# EAGLE design USB3.0 to SATA (EAGLE 9.6.2)

## Sheet 1 of 2: Control_Board
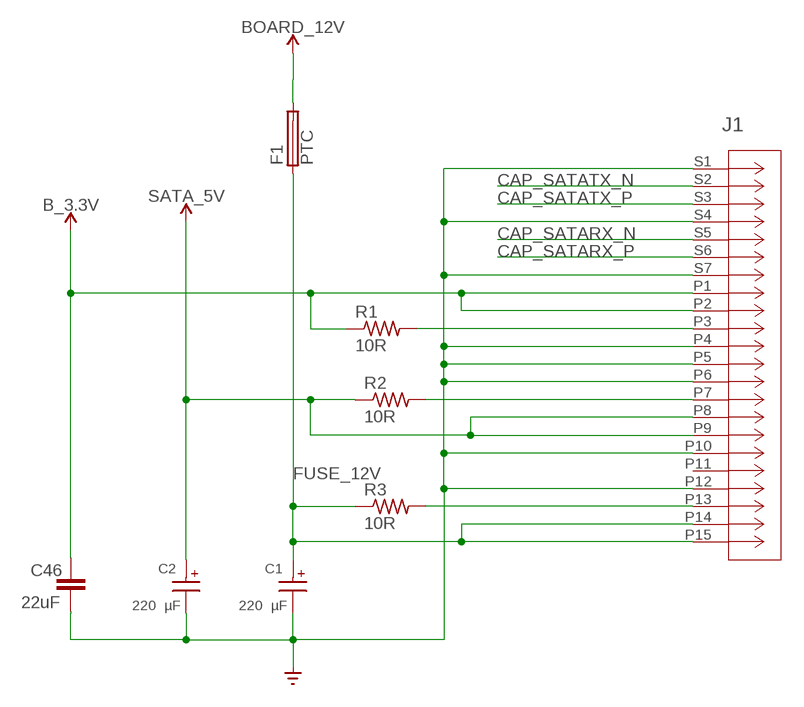
[diagram p0: schematic, sheet 1, part 1 of 2]
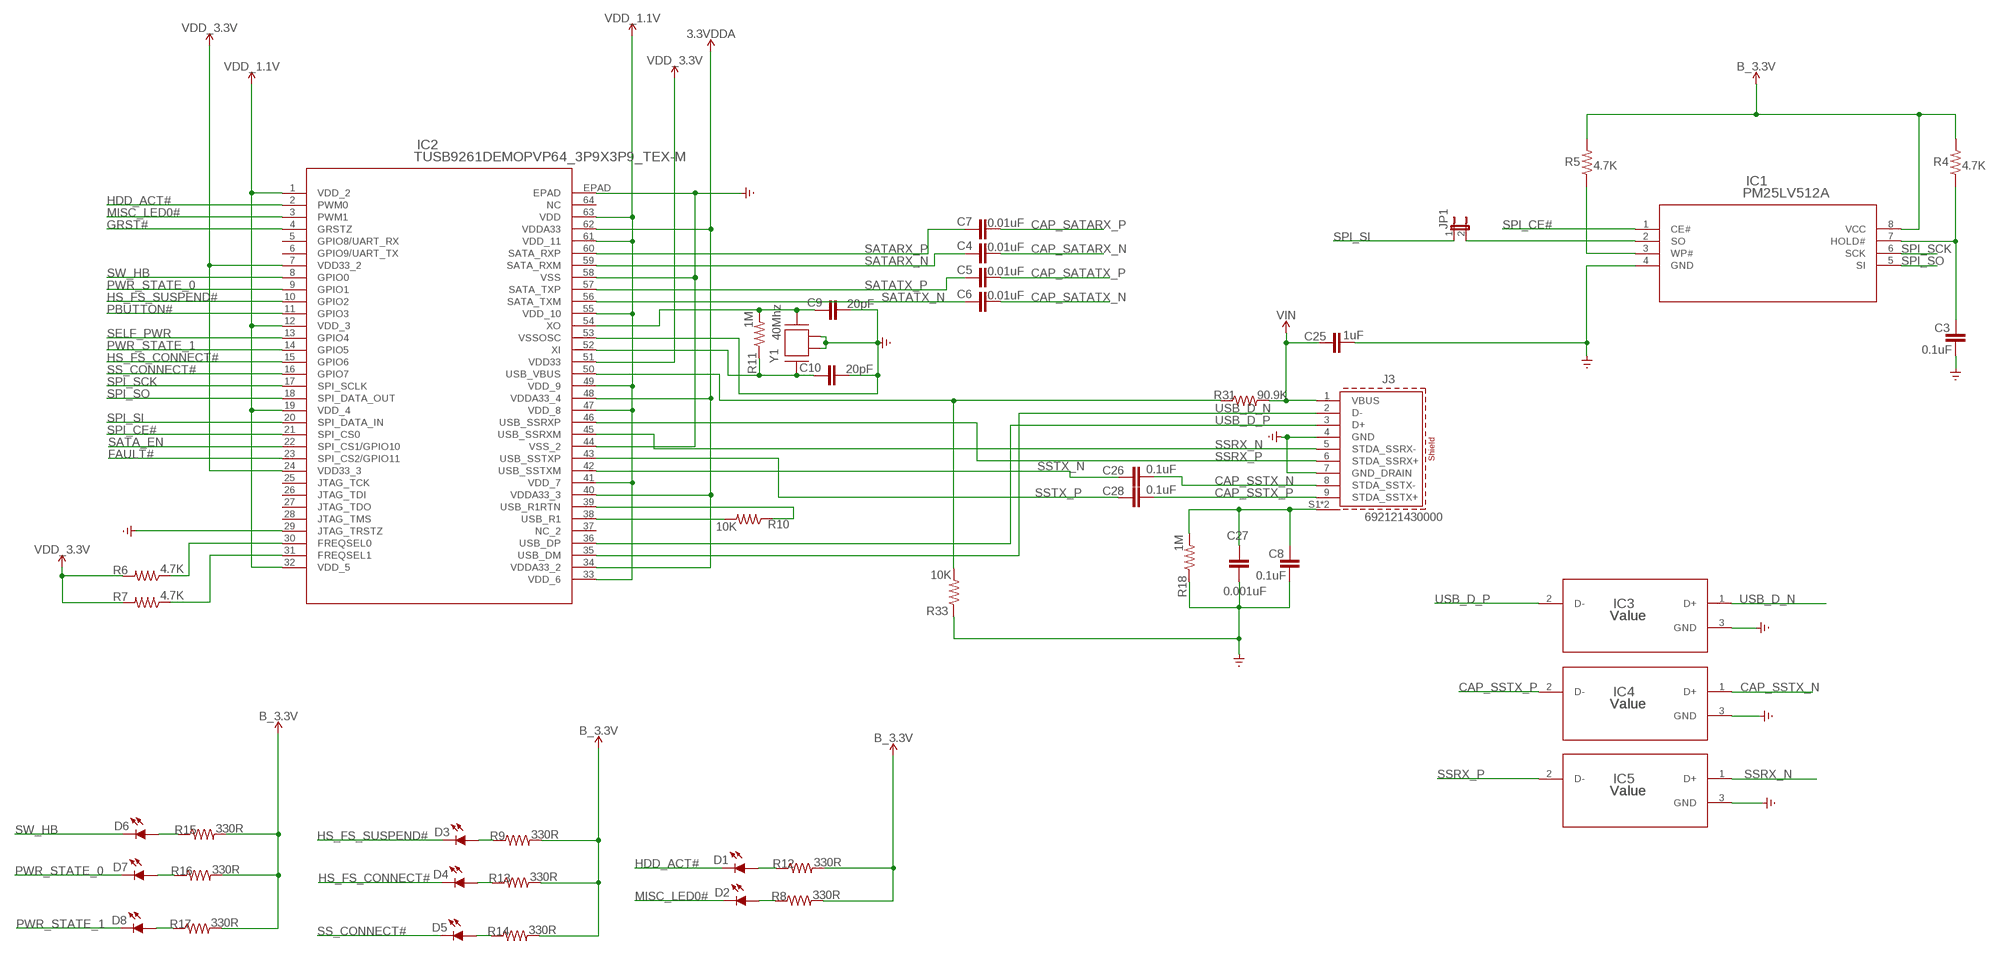
[diagram p1: schematic, sheet 1, part 2 of 2]

### Parts
C1  220 µF  WCAP-ATUL_8X11.5_860040374004  [WCAP-ATUL_8X11.5(DXL)]
C2  220 µF  WCAP-ATUL_8X11.5_860040374004  [WCAP-ATUL_8X11.5(DXL)]
C3  0.1uF  CC0402CRNPO9BN1R0  [CAP_0402]
C4  0.01uF  CC0402CRNPO9BN1R0  [CAP_0402]
C5  0.01uF  CC0402CRNPO9BN1R0  [CAP_0402]
C6  0.01uF  CC0402CRNPO9BN1R0  [CAP_0402]
C7  0.01uF  CC0402CRNPO9BN1R0  [CAP_0402]
C8  0.1uF  CC0402CRNPO9BN1R0  [CAP_0402]
C9  20pF  CC0402CRNPO9BN1R0  [CAP_0402]
C10  20pF  CC0402CRNPO9BN1R0  [CAP_0402]
C25  1uF  CC0402CRNPO9BN1R0  [CAP_0402]
C26  0.1uF  CC0402CRNPO9BN1R0  [CAP_0402]
C27  0.001uF  CC0402CRNPO9BN1R0  [CAP_0402]
C28  0.1uF  CC0402CRNPO9BN1R0  [CAP_0402]
C46  22uF  CC0402CRNPO9BN1R0  [CAP_0402]
D1  LED_LEDCHIP-LED0603MP  [LED_CHIP-LED0603MP]
D2  LED_LEDCHIP-LED0603MP  [LED_CHIP-LED0603MP]
D3  LED_LEDCHIP-LED0603MP  [LED_CHIP-LED0603MP]
D4  LED_LEDCHIP-LED0603MP  [LED_CHIP-LED0603MP]
D5  LED_LEDCHIP-LED0603MP  [LED_CHIP-LED0603MP]
D6  LED_LEDCHIP-LED0603MP  [LED_CHIP-LED0603MP]
D7  LED_LEDCHIP-LED0603MP  [LED_CHIP-LED0603MP]
D8  LED_LEDCHIP-LED0603MP  [LED_CHIP-LED0603MP]
F1  PTC  FUSE_NANOSMDC020F-2_CHIP-1206  [FUSC3215X82N]
IC1  PM25LV512A  [SOIC8-N_MC_MCH]
IC2  TUSB9261DEMOPVP64_3P9X3P9_TEX-M  [PVP64_3P9X3P9_TEX-M]
IC3  Value  TPD2EUSB30DRTR  [DRT0003A]
IC4  Value  TPD2EUSB30DRTR  [DRT0003A]
IC5  Value  TPD2EUSB30DRTR  [DRT0003A]
J1  10031569-001LF  [CONN_10031569-001LF_AMP]
J3  692121430000  [692121430000]
JP1  JP1E  [JP1]
R1  10R  RC0603JR-070RL  [RES_0603]
R2  10R  RC0603JR-070RL  [RES_0603]
R3  10R  RC0603JR-070RL  [RES_0603]
R4  4.7K  RC0402JR-070RL  [RES_0402]
R5  4.7K  RC0402JR-070RL  [RES_0402]
R6  4.7K  RC0402JR-070RL  [RES_0402]
R7  4.7K  RC0402JR-070RL  [RES_0402]
R8  330R  RC0603JR-070RL  [RES_0603]
R9  330R  RC0603JR-070RL  [RES_0603]
R10  10K  RC0402JR-070RL  [RES_0402]
R11  1M  RC0402JR-070RL  [RES_0402]
R12  330R  RC0603JR-070RL  [RES_0603]
R13  330R  RC0603JR-070RL  [RES_0603]
R14  330R  RC0603JR-070RL  [RES_0603]
R15  330R  RC0603JR-070RL  [RES_0603]
R16  330R  RC0603JR-070RL  [RES_0603]
R17  330R  RC0603JR-070RL  [RES_0603]
R18  1M  RC0402JR-070RL  [RES_0402]
R31  90.9K  RC0402JR-070RL  [RES_0402]
R33  10K  RC0402JR-070RL  [RES_0402]
Y1  40Mhz  ABM3B-40.000MHZ-B2-T  [ABM3B-40.000MHZ-B2-T]

### Nets
2.8V [Power]: IC2.7(VDD33_2) IC2.24(VDD33_3) IC2.51(VDD33) R6.2 R7.2 ; supply symbol labelled VDD_3.3V ; also sheet 2
3.3VDDA [Power]: IC2.34(VDDA33_2) IC2.40(VDDA33_3) IC2.48(VDDA33_4) IC2.62(VDDA33) ; also sheet 2
5V [Power]: C2.1(+) J1.P8 J1.P9 R2.1 ; supply symbol labelled SATA_5V ; also sheet 2
12V [Power]: F1.2 ; supply symbol labelled BOARD_12V ; also sheet 2
B_3.3V [Power]: C46.2 IC1.8(VCC) J1.P1 J1.P2 R1.1 R4.2 R5.2 R8.2 R9.2 R12.2 R13.2 R14.2 R15.2 R16.2 R17.2 ; also sheet 2
CAP_SATARX_N [Diff_Pair]: C4.2 J1.S5
CAP_SATARX_P [Diff_Pair]: C7.2 J1.S6
CAP_SATATX_N [Diff_Pair]: C6.2 J1.S2
CAP_SATATX_P [Diff_Pair]: C5.2 J1.S3
CAP_SSTX_N [Diff_Pair]: C26.1 IC4.1(D+) J3.8(STDA_SSTX-)
CAP_SSTX_P [Diff_Pair]: C28.1 IC4.2(D-) J3.9(STDA_SSTX+)
FAULT#: IC2.23(SPI_CS2/GPIO11) ; also sheet 2
FUSE_12V [Power]: C1.1(+) F1.1 J1.P14 J1.P15 R3.1
GND [Power]: C1.2(-) C2.2(-) C3.1 C8.1 C9.2 C10.2 C25.1 C27.2 C46.1 IC1.4(GND) IC2.29(JTAG_TRSTZ) IC2.44(VSS_2) IC2.53(VSSOSC) IC2.58(VSS) IC2.EPAD IC3.3(GND) IC4.3(GND) IC5.3(GND) J1.P4 J1.P5 J1.P6 J1.P10 J1.P12 J1.S1 J1.S4 J1.S7 J3.4(GND) J3.7(GND_DRAIN) R18.1 R33.1 Y1.2 Y1.4 ; also sheet 2
GRST#: IC2.4(GRSTZ) ; also sheet 2
HDD_ACT#: D1.C IC2.2(PWM0)
HS_FS_CONNECT#: D4.C IC2.15(GPIO6)
HS_FS_SUSPEND#: D3.C IC2.10(GPIO2)
MISC_LED0#: D2.C IC2.3(PWM1)
N$1: J1.P3 R1.2
N$2: J1.P13 R3.2
N$3: J1.P7 R2.2
N$16: IC1.2(SO) JP1.2
N$18: IC1.3(WP#) R5.1
N$19: C3.2 IC1.7(HOLD#) R4.1
N$22: IC2.30(FREQSEL0) R6.1
N$23: IC2.31(FREQSEL1) R7.1
N$24: IC2.38(USB_R1) R10.2
N$25: IC2.39(USB_R1RTN) R10.1
N$26: C10.1 IC2.52(XI) R11.1 Y1.1
N$27: C9.1 IC2.54(XO) R11.2 Y1.3
N$28: D1.A R12.1
N$29: D2.A R8.1
N$30: D3.A R9.1
N$31: D4.A R13.1
N$32: D5.A R14.1
N$33: D6.A R15.1
N$34: D7.A R16.1
N$35: D8.A R17.1
N$50: IC2.50(USB_VBUS) R31.1 R33.2
N$54: C8.2 C27.1 J3.S1(SHIELD) J3.S2(SHIELD) R18.2
PBUTTON#: IC2.11(GPIO3)
PWR_STATE_0: D7.C IC2.9(GPIO1)
PWR_STATE_1: D8.C IC2.14(GPIO5)
SATA_EN: IC2.22(SPI_CS1/GPIO10) ; also sheet 2
SATARX_N [Diff_Pair]: C4.1 IC2.59(SATA_RXM)
SATARX_P [Diff_Pair]: C7.1 IC2.60(SATA_RXP)
SATATX_N [Diff_Pair]: C6.1 IC2.56(SATA_TXM)
SATATX_P [Diff_Pair]: C5.1 IC2.57(SATA_TXP)
SELF_PWR: IC2.13(GPIO4)
SPI_CE#: IC1.1(CE#) IC2.21(SPI_CS0)
SPI_SCK: IC1.6(SCK) IC2.17(SPI_SCLK)
SPI_SI: IC2.20(SPI_DATA_IN) JP1.1
SPI_SO: IC1.5(SI) IC2.18(SPI_DATA_OUT)
SS_CONNECT#: D5.C IC2.16(GPIO7)
SSRX_N [Diff_Pair]: IC2.45(USB_SSRXM) IC5.1(D+) J3.5(STDA_SSRX-)
SSRX_P [Diff_Pair]: IC2.46(USB_SSRXP) IC5.2(D-) J3.6(STDA_SSRX+)
SSTX_N [Diff_Pair]: C26.2 IC2.42(USB_SSTXM)
SSTX_P [Diff_Pair]: C28.2 IC2.43(USB_SSTXP)
SW_HB: D6.C IC2.8(GPIO0)
USB_D_N [Diff_Pair]: IC2.35(USB_DM) IC3.1(D+) J3.2(D-)
USB_D_P [Diff_Pair]: IC2.36(USB_DP) IC3.2(D-) J3.3(D+)
VDD_1.1V [Power]: IC2.1(VDD_2) IC2.12(VDD_3) IC2.19(VDD_4) IC2.32(VDD_5) IC2.33(VDD_6) IC2.41(VDD_7) IC2.47(VDD_8) IC2.49(VDD_9) IC2.55(VDD_10) IC2.61(VDD_11) IC2.63(VDD) ; also sheet 2
VIN [Power]: C25.2 J3.1(VBUS) R31.2 ; also sheet 2
Unconnected: IC2.5(GPIO8/UART_RX) IC2.6(GPIO9/UART_TX) IC2.25(JTAG_TCK) IC2.26(JTAG_TDI) IC2.27(JTAG_TDO) IC2.28(JTAG_TMS) IC2.37(NC_2) IC2.64(NC) J1.P11

## Sheet 2 of 2: Power
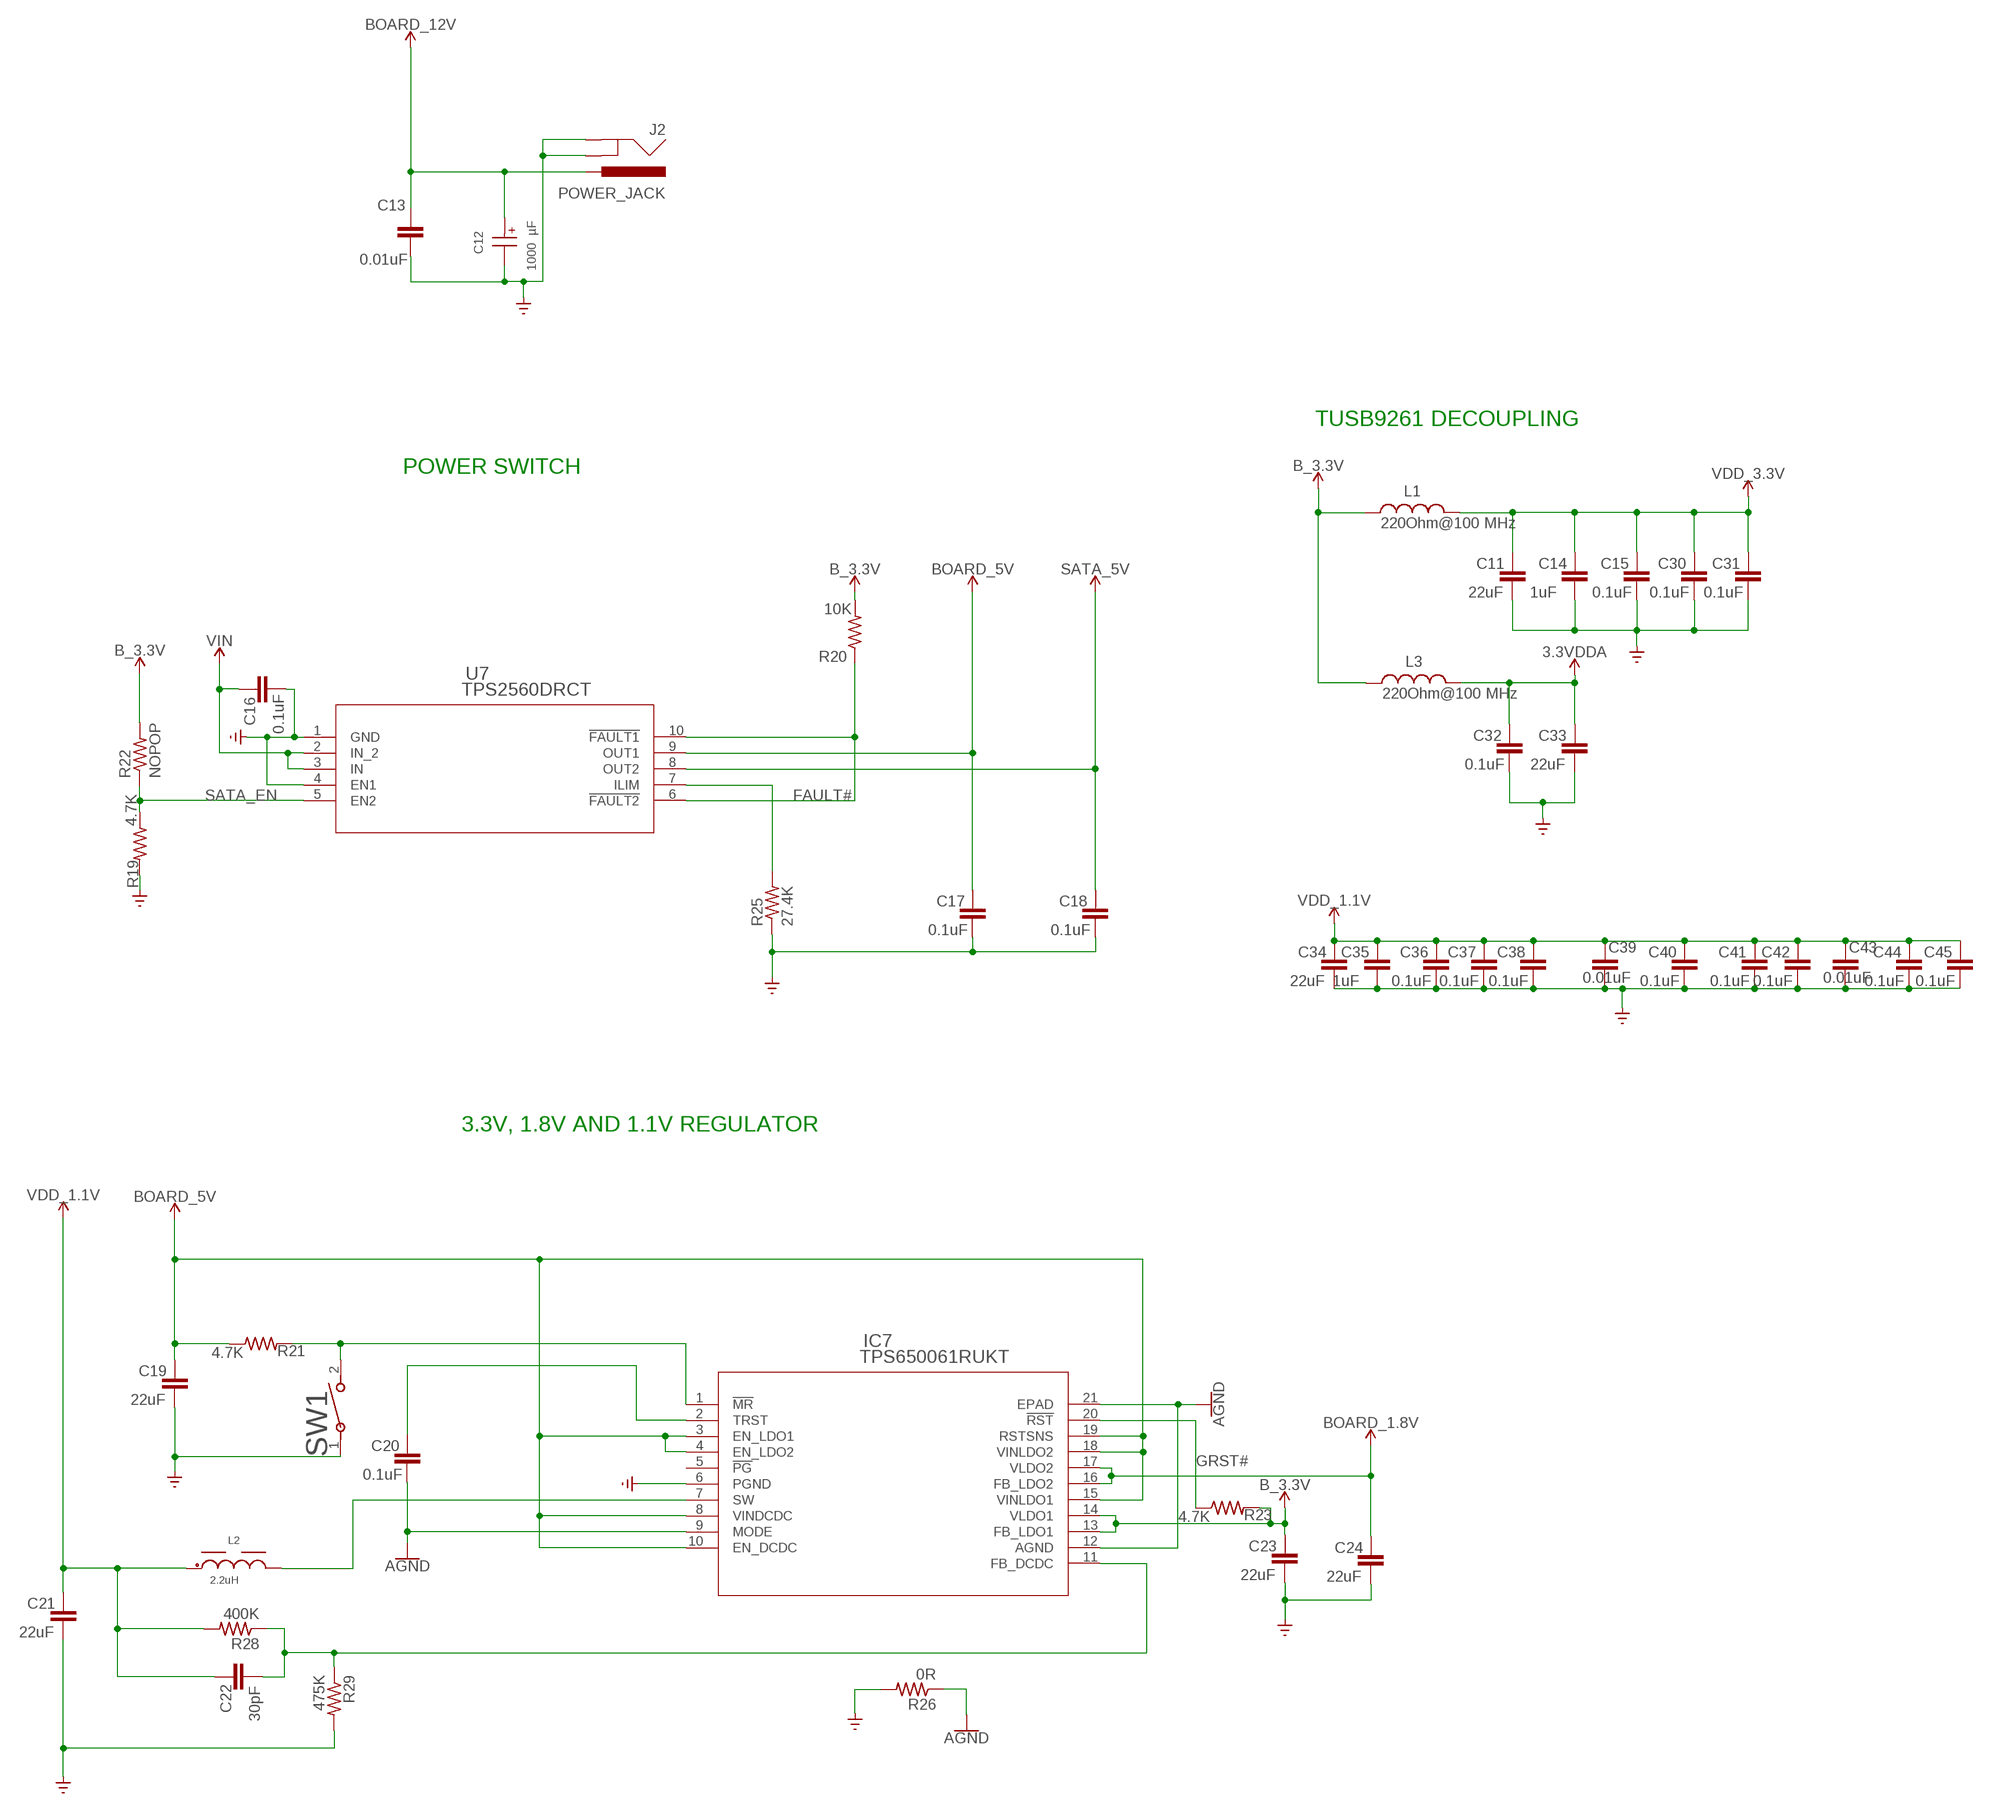
[diagram p2: schematic, sheet 2]

### Parts
C11  22uF  CC0402CRNPO9BN1R0  [CAP_0402]
C12  1000 µF  WCAP-ATLL_10X16_860160375032  [WCAP-ATLL_10X16(DXL)]
C13  0.01uF  CC0402CRNPO9BN1R0  [CAP_0402]
C14  1uF  CC0402CRNPO9BN1R0  [CAP_0402]
C15  0.1uF  CC0402CRNPO9BN1R0  [CAP_0402]
C16  0.1uF  CC0402CRNPO9BN1R0  [CAP_0402]
C17  0.1uF  CC0402CRNPO9BN1R0  [CAP_0402]
C18  0.1uF  CC0402CRNPO9BN1R0  [CAP_0402]
C19  22uF  CC0402CRNPO9BN1R0  [CAP_0402]
C20  0.1uF  CC0402CRNPO9BN1R0  [CAP_0402]
C21  22uF  CC0402CRNPO9BN1R0  [CAP_0402]
C22  30pF  CC0402CRNPO9BN1R0  [CAP_0402]
C23  22uF  CC0402CRNPO9BN1R0  [CAP_0402]
C24  22uF  CC0402CRNPO9BN1R0  [CAP_0402]
C30  0.1uF  CC0402CRNPO9BN1R0  [CAP_0402]
C31  0.1uF  CC0402CRNPO9BN1R0  [CAP_0402]
C32  0.1uF  CC0402CRNPO9BN1R0  [CAP_0402]
C33  22uF  CC0402CRNPO9BN1R0  [CAP_0402]
C34  22uF  CC0402CRNPO9BN1R0  [CAP_0402]
C35  1uF  CC0402CRNPO9BN1R0  [CAP_0402]
C36  0.1uF  CC0402CRNPO9BN1R0  [CAP_0402]
C37  0.1uF  CC0402CRNPO9BN1R0  [CAP_0402]
C38  0.1uF  CC0402CRNPO9BN1R0  [CAP_0402]
C39  0.01uF  CC0402CRNPO9BN1R0  [CAP_0402]
C40  0.1uF  CC0402CRNPO9BN1R0  [CAP_0402]
C41  0.1uF  CC0402CRNPO9BN1R0  [CAP_0402]
C42  0.1uF  CC0402CRNPO9BN1R0  [CAP_0402]
C43  0.01uF  CC0402CRNPO9BN1R0  [CAP_0402]
C44  0.1uF  CC0402CRNPO9BN1R0  [CAP_0402]
C45  0.1uF  CC0402CRNPO9BN1R0  [CAP_0402]
IC7  TPS650061RUKT  [RUK20_1P7X1P7]
J2  POWER_JACK  [POWER_JACK_PTH]
L1  220Ohm@100 MHz  WE-CBF_0603_74279263_WB_HS  [WE-CBF_0603(W=2.2)]
L2  2.2uH  WE-MAPI_4020_74438356022  [WE-MAPI_4020]
L3  220Ohm@100 MHz  WE-CBF_0603_74279263_WB_HS  [WE-CBF_0603(W=2.2)]
R19  4.7K  RC0402JR-070RL  [RES_0402]
R20  10K  RC0402JR-070RL  [RES_0402]
R21  4.7K  RC0402JR-070RL  [RES_0402]
R22  NOPOP  RC0402JR-070RL  [RES_0402]
R23  4.7K  RC0402JR-070RL  [RES_0402]
R25  27.4K  RC0402JR-070RL  [RES_0402]
R26  0R  RC0402JR-070RL  [RES_0402]
R28  400K  RC0402JR-070RL  [RES_0402]
R29  475K  RC0402JR-070RL  [RES_0402]
SW1  EVP-AWED2A  [SW_EVP-AWED2A_PAN]
U7  TPS2560DRCT  [DRC10_2P4X1P65]

### Nets
1.8V [Power]: C24.2 IC7.16(FB_LDO2) IC7.17(VLDO2) ; supply symbol labelled BOARD_1.8V
2.8V [Power]: C11.2 C14.2 C15.2 C30.2 C31.2 L1.2 ; supply symbol labelled VDD_3.3V ; also sheet 1
3.3VDDA [Power]: C32.2 C33.2 L3.2 ; also sheet 1
5V [Power]: C18.2 U7.8(OUT2) ; supply symbol labelled SATA_5V ; also sheet 1
12V [Power]: C12.1(+) C13.1 J2.PWR ; supply symbol labelled BOARD_12V ; also sheet 1
AGND [Power]: C20.1 IC7.9(MODE) IC7.12(AGND) IC7.21(EPAD) R26.1
B_3.3V [Power]: C23.2 IC7.13(FB_LDO1) IC7.14(VLDO1) L1.1 L3.1 R20.2 R22.2 R23.2 ; also sheet 1
BOARD_5V [Power]: C17.2 C19.2 IC7.3(EN_LDO1) IC7.4(EN_LDO2) IC7.8(VINDCDC) IC7.10(EN_DCDC) IC7.15(VINLDO1) IC7.18(VINLDO2) IC7.19(RSTSNS) R21.1 U7.9(OUT1)
FAULT#: R20.1 U7.6(!FAULT2) U7.10(!FAULT1) ; also sheet 1
GND [Power]: C11.1 C12.2(-) C13.2 C14.1 C15.1 C16.1 C17.1 C18.1 C19.1 C21.1 C23.1 C24.1 C30.1 C31.1 C32.1 C33.1 C34.1 C35.1 C36.1 C37.1 C38.1 C39.2 C40.1 C41.1 C42.1 C43.2 C44.1 C45.1 IC7.6(PGND) J2.GND J2.GNDBREAK R19.2 R25.1 R26.2 R29.2 SW1.1 U7.1(GND) U7.4(EN1) ; also sheet 1
GRST#: IC7.20(!RST) R23.1 ; also sheet 1
N$12: IC7.1(!MR) R21.2 SW1.2
N$13: R25.2 U7.7(ILIM)
N$14: C20.2 IC7.2(TRST)
N$46: IC7.7(SW) L2.2
N$48: C22.1 IC7.11(FB_DCDC) R28.1 R29.1
SATA_EN: R19.1 R22.1 U7.5(EN2) ; also sheet 1
VDD_1.1V [Power]: C21.2 C22.2 C34.2 C35.2 C36.2 C37.2 C38.2 C39.1 C40.2 C41.2 C42.2 C43.1 C44.2 C45.2 L2.1 R28.2 ; also sheet 1
VIN [Power]: C16.2 U7.2(IN_2) U7.3(IN) ; also sheet 1
Unconnected: IC7.5(!PG)

### Notes on the sheet
- TUSB9261 DECOUPLING
- POWER SWITCH
- 3.3V, 1.8V AND 1.1V REGULATOR

## Library data of the parts
C1 C2 = Wurth_Capacitors_WCAP-ATUL:WCAP-ATUL_8X11.5: WCAP-ATUL Aluminum Electrolytic Capacitors Low Leakage & Long Life Characteristics Low leakage current and long life product series Mounting style: THT Radial Capacitance range: 22 µF ‒ 4700 µF Capacitance tolerance: ±20 % Voltage range (UR): 10 ‒ 100 V(DC) Operating temperature: -40 °C up to +105 °C Endurance: 4000 ‒ 10000 h @ +105 °C Dimensions (DxL) in mm: 5.0 x 11.0 up to 18.0 x 41 Recommended soldering: Wave soldering Applications Durable battery applications Filtering Smoothing Energy storage Coupling e.g. Switched-mode power supply, AC/DC converter, adapter, charger, digital camera <https://www.we-online.com/catalog/media/o14731v209%20Family_WCAP-ATUL.jpg> Details see: https://www.we-online.com/catalog/en/WCAP-ATUL/ Updated by yingchun,Shan;2020-03-02 2020(C) Würth Elektronik; DATASHEET-URL: https://www.we-online.com/catalog/datasheet/860040374004.pdf; DF: 16%; DIAMETER: 8mm; I-LEAK: 35.2uA; I-RIPPLE: 480mA; L: 11.5mm; MPN: 860040374004; OPERATING-TEMPERATURE: -40 °C up to +105 °C; PART-NUMBER: 860040374004; PITCH: 3.5mm; TECHNICAL-REFERENCE: ATDE115221M016DSPA7G000; VR: 16V(DC)
C3 C8 C15-C18 C20 C26 C28 C30-C32 C36-C38 C40-C42 C44 C45 = Resistor_Capacitor:CC0402CRNPO9BN1R0: CAP CER 1PF 50V C0G/NPO 0402 Manufacturer's datasheet <http://www.yageo.com/documents/recent/UPY-GP_NP0_16V-to-50V_16.pdf>; CREATED_BY: PCBLayout.com; DIGIKEY_PART_NUMBER: 311-3559-1-ND; MANUFACTURER: Yageo; MPN: CC0402KPX7R7BB104; PACKAGE: SMD 0402
C4-C7 C13 C39 C43 = Resistor_Capacitor:CC0402CRNPO9BN1R0: CAP CER 1PF 50V C0G/NPO 0402 Manufacturer's datasheet <http://www.yageo.com/documents/recent/UPY-GP_NP0_16V-to-50V_16.pdf>; CREATED_BY: PCBLayout.com; DIGIKEY_PART_NUMBER: 490-6326-1-ND; MANUFACTURER: Murata Electronics; MPN: GRM155R71C103KA01J; PACKAGE: SMD 0402
C9 C10 = Resistor_Capacitor:CC0402CRNPO9BN1R0: CAP CER 1PF 50V C0G/NPO 0402 Manufacturer's datasheet <http://www.yageo.com/documents/recent/UPY-GP_NP0_16V-to-50V_16.pdf>; CREATED_BY: PCBLayout.com; DIGIKEY_PART_NUMBER: 478-11758-1-ND; MANUFACTURER: AVX Corporation; MPN: 04023U200JAT2A; PACKAGE: SMD 0402
C11 C19 C21 C23 C24 C33 C34 C46 = Resistor_Capacitor:CC0402CRNPO9BN1R0: CAP CER 1PF 50V C0G/NPO 0402 Manufacturer's datasheet <http://www.yageo.com/documents/recent/UPY-GP_NP0_16V-to-50V_16.pdf>; CREATED_BY: PCBLayout.com; DIGIKEY_PART_NUMBER: 1276-7090-1-ND; MANUFACTURER: Samsung Electro-Mechanics; MPN: CL05A226MQ5N6J8; PACKAGE: SMD 0402
C12 = Wurth_Capacitors_WCAP-ATLL:WCAP-ATLL_10X16: WCAP-ATLL Aluminum Electrolytic Capacitors Long Life +105 °C Characteristics Long life product series Mounting style: THT Radial Capacitance range: 0.47 µF ‒ 6800 µF Capacitance tolerance: ±20 % Voltage range (UR): 10 ‒ 50 V(DC) Operating temperature: -55 °C up to +105 °C Endurance: 3000 ‒ 10000 h @ +105 °C Dimensions (DxL) in mm: 5.0 x 11.0 up to 18.0 x 35.5 Recommended soldering: Wave soldering Applications Long life application Filtering Smoothing Energy storage Coupling e.g. Switched-mode power supply, AC/DC converter, adapter, charger, digital camera <https://www.we-online.com/catalog/media/o14730v209%20Family_WCAP-ATLL.jpg> Details see: https://www.we-online.com/catalog/en/WCAP-ATLL/ Updated by yingchun,Shan;2020-03-02 2020(C) Würth Elektronik; DATASHEET-URL: https://www.we-online.com/catalog/datasheet/860160375032.pdf; DF: 16%; DIAMETER: 10mm; I-LEAK: 160uA; I-RIPPLE: 1404mA; L: 16mm; MPN: 860160375032; OPERATING-TEMPERATURE: -55 °C up to +105 °C; PART-NUMBER: 860160375032; PITCH: 5mm; TECHNICAL-REFERENCE: ATEF160102M016DSPAAF000; VR: 16V(DC)
C14 C25 C35 = Resistor_Capacitor:CC0402CRNPO9BN1R0: CAP CER 1PF 50V C0G/NPO 0402 Manufacturer's datasheet <http://www.yageo.com/documents/recent/UPY-GP_NP0_16V-to-50V_16.pdf>; CREATED_BY: PCBLayout.com; DIGIKEY_PART_NUMBER: 311-1691-1-ND; MANUFACTURER: Yageo; MPN: CC0402KRX5R7BB105; PACKAGE: SMD 0402
C22 = Resistor_Capacitor:CC0402CRNPO9BN1R0: CAP CER 1PF 50V C0G/NPO 0402 Manufacturer's datasheet <http://www.yageo.com/documents/recent/UPY-GP_NP0_16V-to-50V_16.pdf>; CREATED_BY: PCBLayout.com; DIGIKEY_PART_NUMBER: 490-7752-1-ND; MANUFACTURER: Murata Electronics; MPN: GRM1555C1E300JA01D; PACKAGE: SMD 0402
C27 = Resistor_Capacitor:CC0402CRNPO9BN1R0: CAP CER 1PF 50V C0G/NPO 0402 Manufacturer's datasheet <http://www.yageo.com/documents/recent/UPY-GP_NP0_16V-to-50V_16.pdf>; CREATED_BY: PCBLayout.com; DIGIKEY_PART_NUMBER: 311-1712-1-ND; MANUFACTURER: Yageo; MPN: CC0402KRX7R8BB102; PACKAGE: SMD 0402
D1-D8 = 52101-101-REV-A_v16:LED_LED: LED Various Types; DIGIKEY_PART_NUMBER: 2460-L196L-SGC-TR-ND
F1 = Circuit-Protection:FUSE_: Fuse - Popular parts; CATEGORY: Circuit-Protection; DESCRIPTION: PTC RESET FUSE 21V 4A 1206; MANUFACTURER: Littelfuse Inc.; MPN: 400CC1206LR-C-2; SUB-CATEGORY: Fuse; VALUE: NANOSMDC020F
IC1 = TUSB:PM25LV512A
IC2 = TUSB:TUSB9261DEMO; BUILT_BY: EMA_UL_Team; COPYRIGHT: Copyright (C) 2018 Accelerated Designs. All rights reserved; MANUFACTURER_PART_NUMBER: TUSB9261DEMO; SOURCELIBRARY: TI_2019-03-28; VENDOR: Texas Instruments
IC3-IC5 = TUSB:TPD2EUSB30DRTR; MANUFACTURER: Texas Instruments; PARTNUMBER: TPD2EUSB30DRTR; REFDES: RefDes; TYPE: TYPE
IC7 = TUSB:TPS650061RUKT; DATASHEET_URL: http://www.ti.com/lit/gpn/TPS650061; DESCRIPTION: 2.25MHz Step-Down Converter with Dual LDOs & SVS; FAMILY_NAME: PMIC SOLUTIONS WITH AND WITHOUT BATTERY CHARGER; GENERIC_PART_NUMBER: TPS650061; INDUSTRY_STD_PKG_TYPE: QFN; MANUFACTURER: Texas Instruments; MANUFACTURER_PART_NUMBER: TPS650061RUKT; PACKAGE_DESIGNATOR: RUK; PIN_COUNT: 20; VENDOR: Texas Instruments
J1 = TUSB:10031569-001LF; BUILT_BY: EMA_Cory; COPYRIGHT: Copyright (C) 2018 Accelerated Designs. All rights reserved; DATASHEET: https://www.amphenol-icc.com/media/wysiwyg/files/drawing/10031569.pdf?__cf_chl_jschl_tk__=54b377553426e72d1abc39edab2c20617d1660fe-1606336260-0-AWbvkkaXBuUcaQksGGxy5demMRSHc7bNjc4k2PjG-qFcJ31sxf1Jg-jb0ixgneuRTz7duFgRIszKrHMh4ZNBUbJ0f5CBrMzAJ2YBXIVZxYAcw57zKftB24I3CcOzflvCGOao7jtSlByXa-sURvSiKF3WUiIjWAy2-j_C3Zpi4h2om_XivUMxXCTkkgxld3EJPcF_W42VKHzVlZWszNSQnlI7DC79jmCOM0tyX-EBpy3nL80jNT8xKngivycZ2wOigElWF8yBrr7zQBAmUJisYVwwisz03Z_A_y1RChWLBZgXRPAV9Ff7vfHyF0o3uCmnaaGca9oOtju3Kqp_SEisjOxQc03pFhsE6xQVwsGZ1ZK1rXAdOXQLmyQv21mF787c0OVDTnWLl4D2mX3zqG9mRXsURM21A7YAb0PQRK5vuJx3; MANUFACTURER_PART_NUMBER: 10031569-001LF; SOURCELIBRARY: Add_to_database_2020-11-25; VENDOR: Amphenol
J2 = SparkFun-Connectors:POWER_JACK: Power Jack Connector This is the standard 5.5mm barrel jack for power. The PTH is the most common, proven, reliable, footprint. The Slot footprint only works if the mill layer is transmitted to the PCB fab house so be warned. Here are the connectors we sell at SparkFun: DC Barrel Power Jack/Connector <https://www.sparkfun.com/products/119> (PRT-00119) DC Barrel Power Jack/Connector (SMD) <https://www.sparkfun.com/products/12748> (PRT-12748) DC Barrel Jack Adapter - Breadboard Compatible <https://www.sparkfun.com/products/10811> (PRT-10811) It is used on this SparkFun product (and many, many others): SparkFun RedBoard - Programmed with Arduino <https://www.sparkfun.com/products/12757> (DEV-12757) Also, if you need a mating power supply or connector, please check these out: Wall Adapter Power Supply - 9VDC 650mA <https://www.sparkfun.com/products/298> (TOL-00298) DC Barrel Jack Adapter - Male <https://www.sparkfun.com/products/10287> (PRT-10287); PROD_ID: CONN-08197
J3 = Wurth_Connectors_WR-USB:692121430000: WR-COM USB 3.0 Type A Vertical THT Kind Properties Durability:5 000 Mating cycles Quality Class:5 000 Mating cycles Connector Type:USB Gender:Receptacle Type:Vertical General Information Operating Temperature:-20up to +85 °C Compliance:RoHS Electrical Properties IR 1:1.8A Working Voltage:30V (AC) Withstanding Voltage:100V (AC) Contact Resistance:50 mΩ Material Properties Insulator Material:LCP Insulator Flammability Rating:UL94 V-0 Color:Blue Contact Material:Copper Alloy Contact Plating:Selective Gold Contact Type:Stamped Shielding Material:INOX Steel <https://www.we-online.com/catalog/media/o58971v209%20Family_WR-COM_USB_3.0_Vertical_692121430000.jpg> Details see: https://www.we-online.com/catalog/en/COM_3_0_THT_TYPE_A_VERTICAL/ Updated by Yingchun, Shan 2020-01-16 2020 (C) Würth Elektronik; APPLICATION: USB 3.0; DATASHEET-URL: https://www.we-online.com/catalog/datasheet/692121430000.pdf; GERDER: Receptacle; INTERFACE-TYPE: Type A; IR1: 1.8A; MOUNT: THT; PACKAGING: Tray; PART-NUMBER: 692121430000; PINS: 9; TYPE: Vertical; WORKING-VOLTAGE: 30V(AC)
JP1 = jumper:JP1E: JUMPER
L1 L3 = Wurth_EMC Components_WE-CBF:WE-CBF_0603: WE-CBF SMD EMI Suppression Ferrite Bead Characteristics Reliable Ni-Sn electrodes High rated current up to 6 A Operating temperature: –55 ºC to +125 ºC Applications Perfect as data lined filter and for uncoupling of distribution voltage Package name and Variant abbreviation: Package: Wide Band /High Speed: W=Width= 2.2 High Current: W=Width= 2.6 Variant abbreviation: WB = Wide Band HS=High Speed HC=High Current <https://www.we-online.com/catalog/media/o14753v209%20Family_WE-CBF.jpg> Details see: https://www.we-online.com/katalog/en/WE-CBF Updated by Ella Wu 2021-1-12 2021(C) Wurth Elektronik; DATASHEET-URL: https://www.we-online.com/catalog/datasheet/74279263.pdf; IR2: 1000mA; MOUNT: SMT; MPN: 74279263; PART-NUMBER: 74279263; RDC-MAX: 0.3Ohm; TYPE: Wide Band; Z-MAX: 280Ohm@350 MHz
L2 = Wurth_Power Magnetics_WE-MAPI:WE-MAPI_4020: WE-MAPI SMD Power Inductor Characteristics Magnetic iron alloy allows high rated currents Compact design Magnetically shielded High current capability and handles high transient current spikes Low acoustic noise and low leakage flux noise Operating temperature: –40 °C to 125 °C Product and Application Spotlight: Stay cool, be MAPI Applications DC/DC-converter for high current power supplies DC/DC-converter for Field Programmable Gate Array (FPGA) POL-converters Portable power like PDA, digital camera Mainboards/graphic cards Battery powered devices Wireless communication devices Power supplies for smart- phones, tablet PCs and other mobile devices <https://www.we-online.com/katalog/media/o14811v209%20Family_WE-MAPI.jpg> Details see: https://www.we-online.com/katalog/en/WE-MAPI Updated by Ella Wu, 2020-12-01 2020(C) Wurth Elektronik; DATASHEET-URL: https://www.we-online.com/catalog/datasheet/74438356022.pdf; FRES: 34MHz; IR: 4.7A; ISAT: 6.2A; MOUNT: SMT; PART-NUMBER: 74438356022; RDC-MAX: 35mOhm; RDC-TYP: 29mOhm
R1-R3 = Resistor_Capacitor:RC0603JR-070RL: RES SMD 0 OHM JUMPER 1/10W 0603 Manufacturer's datasheet <http://www.yageo.com/documents/recent/PYu-RC_Group_51_RoHS_L_10.pdf>; CREATED_BY: PCBLayout.com; DIGIKEY_PART_NUMBER: 511-1693-1-ND; MANUFACTURER: Rohm Semiconductor; MPN: SDR03EZPF10R0; PACKAGE: SMD 0603
R4-R7 R19 R21 R23 = Resistor_Capacitor:RC0402JR-070RL: RES SMD 0 OHM JUMPER 1/16W 0402 Manufacturer's datasheet <http://www.yageo.com/documents/recent/PYu-RC_Group_51_RoHS_L_10.pdf>; CREATED_BY: PCBLayout.com; DIGIKEY_PART_NUMBER: YAG1446CT-ND; MANUFACTURER: Yageo; MPN: RT0402BRD074K7L; PACKAGE: SMD 0402
R8 R9 R12-R17 = Resistor_Capacitor:RC0603JR-070RL: RES SMD 0 OHM JUMPER 1/10W 0603 Manufacturer's datasheet <http://www.yageo.com/documents/recent/PYu-RC_Group_51_RoHS_L_10.pdf>; CREATED_BY: PCBLayout.com; DIGIKEY_PART_NUMBER: 511-1764-1-ND; MANUFACTURER: Rohm Semiconductor; MPN: SDR03EZPJ331; PACKAGE: SMD 0603
R10 R20 R33 = Resistor_Capacitor:RC0402JR-070RL: RES SMD 0 OHM JUMPER 1/16W 0402 Manufacturer's datasheet <http://www.yageo.com/documents/recent/PYu-RC_Group_51_RoHS_L_10.pdf>; CREATED_BY: PCBLayout.com; DIGIKEY_PART_NUMBER: 541-1752-1-ND; MANUFACTURER: Vishay Dale; MPN: RCG04021M00FKED; PACKAGE: SMD 0402
R11 R18 = Resistor_Capacitor:RC0402JR-070RL: RES SMD 0 OHM JUMPER 1/16W 0402 Manufacturer's datasheet <http://www.yageo.com/documents/recent/PYu-RC_Group_51_RoHS_L_10.pdf>; CREATED_BY: PCBLayout.com; DIGIKEY_PART_NUMBER: 13-RE0402BRE071MLCT-ND; MANUFACTURER: Yageo; MPN: RE0402BRE071ML; PACKAGE: SMD 0402
R22 = Resistor_Capacitor:RC0402JR-070RL: RES SMD 0 OHM JUMPER 1/16W 0402 Manufacturer's datasheet <http://www.yageo.com/documents/recent/PYu-RC_Group_51_RoHS_L_10.pdf>; CREATED_BY: PCBLayout.com; DIGIKEY_PART_NUMBER: 311-0.0JRTR-ND; MANUFACTURER: Yageo; MPN: RC0402JR-070RL; PACKAGE: SMD 0402
R25 = Resistor_Capacitor:RC0402JR-070RL: RES SMD 0 OHM JUMPER 1/16W 0402 Manufacturer's datasheet <http://www.yageo.com/documents/recent/PYu-RC_Group_51_RoHS_L_10.pdf>; CREATED_BY: PCBLayout.com; DIGIKEY_PART_NUMBER: YAG4427CT-ND; MANUFACTURER: Yageo; MPN: RT0402DRD0727K4L; PACKAGE: SMD 0402
R26 = Resistor_Capacitor:RC0402JR-070RL: RES SMD 0 OHM JUMPER 1/16W 0402 Manufacturer's datasheet <http://www.yageo.com/documents/recent/PYu-RC_Group_51_RoHS_L_10.pdf>; CREATED_BY: PCBLayout.com; DIGIKEY_PART_NUMBER: 13-AC0402FR-070RLCT-ND; MANUFACTURER: Yageo; MPN: AC0402FR-070RL; PACKAGE: SMD 0402
R28 = Resistor_Capacitor:RC0402JR-070RL: RES SMD 0 OHM JUMPER 1/16W 0402 Manufacturer's datasheet <http://www.yageo.com/documents/recent/PYu-RC_Group_51_RoHS_L_10.pdf>; CREATED_BY: PCBLayout.com; DIGIKEY_PART_NUMBER: 2997-CR204003FTR-ND; MANUFACTURER: Meritek; MPN: CR204003F; PACKAGE: SMD 0402
R29 = Resistor_Capacitor:RC0402JR-070RL: RES SMD 0 OHM JUMPER 1/16W 0402 Manufacturer's datasheet <http://www.yageo.com/documents/recent/PYu-RC_Group_51_RoHS_L_10.pdf>; CREATED_BY: PCBLayout.com; DIGIKEY_PART_NUMBER: 311-475KLRCT-ND; MANUFACTURER: Yageo; MPN: RC0402FR-07475KL; PACKAGE: SMD 0402
R31 = Resistor_Capacitor:RC0402JR-070RL: RES SMD 0 OHM JUMPER 1/16W 0402 Manufacturer's datasheet <http://www.yageo.com/documents/recent/PYu-RC_Group_51_RoHS_L_10.pdf>; CREATED_BY: PCBLayout.com; DIGIKEY_PART_NUMBER: 311-2334-1-ND; MANUFACTURER: Yageo; MPN: RT0402DRE0790K9L; PACKAGE: SMD 0402
SW1 = TUSB:EVP-AWED2A; BUILT_BY: EMA_Cory; COPYRIGHT: Copyright (C) 2018 Accelerated Designs. All rights reserved; MANUFACTURER_PART_NUMBER: EVP-AWED2A; SOURCELIBRARY: Panasonic_2019-12-05; VENDOR: Panasonic
U7 = TUSB:TPS2560DRCT; DATASHEET_URL: http://www.ti.com/lit/gpn/TPS2560; DESCRIPTION: Dual Channel Precision Adjustable Current-Limited Power Switches; FAMILY_NAME: USB POWER SWITCH; GENERIC_PART_NUMBER: TPS2560; INDUSTRY_STD_PKG_TYPE: SON; MANUFACTURER: Texas Instruments; MANUFACTURER_PART_NUMBER: TPS2560DRCT; PACKAGE_DESIGNATOR: DRC; PIN_COUNT: 10; VENDOR: Texas Instruments
Y1 = Crystals_Oscillators:ABM3B-40.000MHZ-B2-T: CRYSTAL 40.0000MHZ 18PF SMD Manufacturer's datasheet <https://abracon.com/Resonators/abm3b.pdf>; CREATED_BY: PCBLayout.com; DIGIKEY_PART_NUMBER: 535-9132-2-ND; MANUFACTURER: Abracon LLC; MPN: ABM3B-40.000MHZ-B2-T; PACKAGE: SMD 4

## Net classes
0 default: width 0.203 mm, drill 0.178 mm, clearance 0.152 mm
1 Diff_Pair: width 0.152 mm, drill 0.178 mm, clearance 0.152 mm
2 Power: width 0.203 mm, drill 0.178 mm, clearance 0.152 mm

## Board
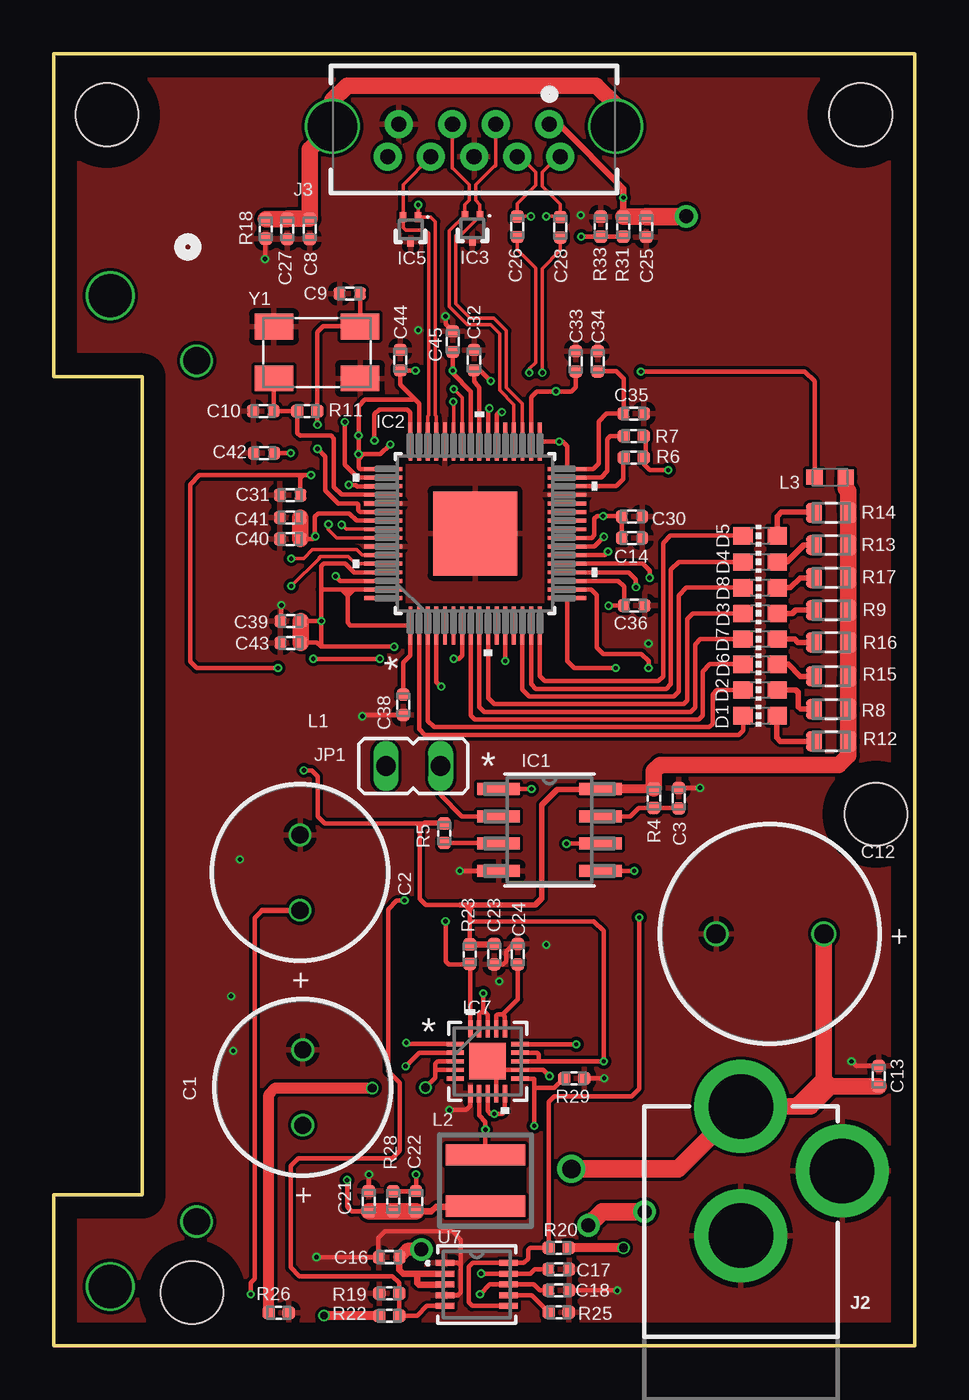
[diagram p3: board, top side]
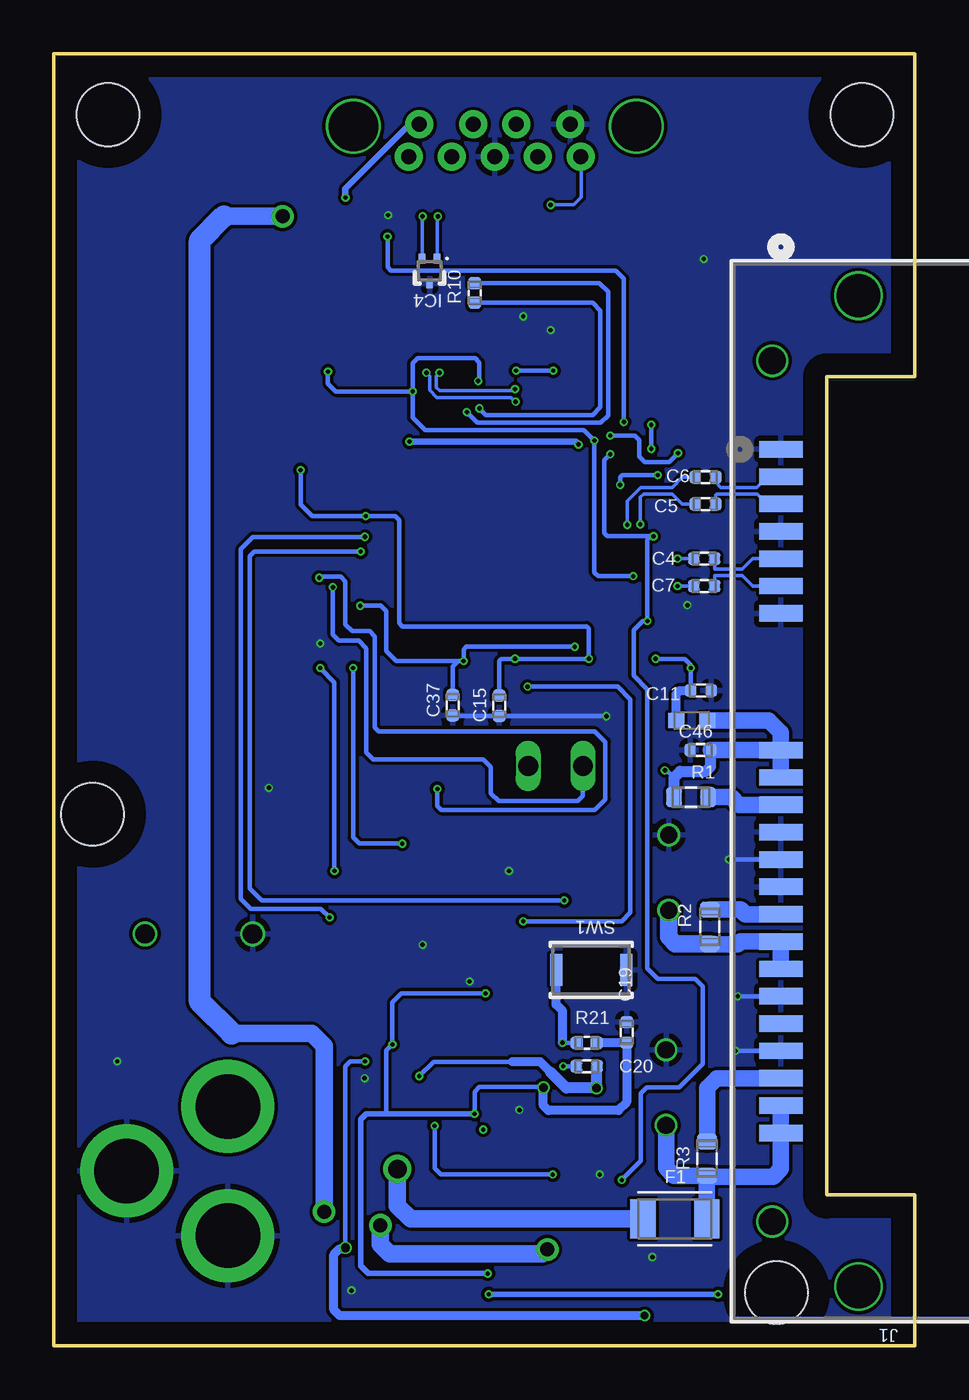
[diagram p4: board, bottom side, seen from below]

Size 39.98 x 60 mm. Coordinates in mm from the lower left corner, seen from the top.
Outline: 0,0 0,7 4.1,7 4.1,45 0,45 0,60 39.98,60 39.98,0 0,0
Copper layers (1*16): Top 0.035mm / dielectric 1.5mm / Bottom 0.035mm
Design rules "default *": minimum track width 6mil, minimum drill 0.2mm, track to track 6mil, track to pad 6mil, pad to pad 6mil, via to via 6mil, smd to smd 6mil, copper to edge 40mil, drill to drill 6mil, minimum pad ring 5mil, minimum via ring 3.5mil, stop-mask expansion 4mil, vias tented up to drill 0mil, thermal gap 10mil
Holes 2.9 mm at 2.46,57.17 37.46,57.17 6.42,2.46 38.18,24.69

### Footprints (pad centres in the part's own frame; a part is rotated, then mirrored left to right if it is on the bottom)
WCAP-ATUL_8X11.5(DXL) = drill 0.8: 1 1.75,0; 2 -1.75,0
CAP_0402 = smd 0.55 x 0.58: 1 -0.475,0; 2 0.475,0
WCAP-ATLL_10X16(DXL) = drill 0.9: 1 2.5,0; 2 -2.5,0
LED_CHIP-LED0603MP = smd 0.8 x 0.9: A 0,-0.794; C 0,0.794
FUSC3215X82N = smd 1.165 x 1.814: 1 -1.475,0; 2 1.475,0
SOIC8-N_MC_MCH = smd 1.981 x 0.559: 1 -2.362,1.905; 2 -2.362,0.635; 3 -2.362,-0.635; 4 -2.362,-1.905; 5 2.362,-1.905; 6 2.362,-0.635; 7 2.362,0.635; 8 2.362,1.905
PVP64_3P9X3P9_TEX-M = smd 1.778 x 0.178: 1 -4.267,3; 2 -4.267,2.6; 3 -4.267,2.2; 4 -4.267,1.8; 5 -4.267,1.4; 6 -4.267,1; 7 -4.267,0.6; 8 -4.267,0.2; 9 -4.267,-0.2; 10 -4.267,-0.6; 11 -4.267,-1; 12 -4.267,-1.4; 13 -4.267,-1.8; 14 -4.267,-2.2; 15 -4.267,-2.6; 16 -4.267,-3; 33 4.267,-3; 34 4.267,-2.6; 35 4.267,-2.2; 36 4.267,-1.8; 37 4.267,-1.4; 38 4.267,-1; 39 4.267,-0.6; 40 4.267,-0.2; 41 4.267,0.2; 42 4.267,0.6; 43 4.267,1; 44 4.267,1.4; 45 4.267,1.8; 46 4.267,2.2; 47 4.267,2.6; 48 4.267,3 | smd 0.178 x 1.778: 17 -3,-4.267; 18 -2.6,-4.267; 19 -2.2,-4.267; 20 -1.8,-4.267; 21 -1.4,-4.267; 22 -1,-4.267; 23 -0.6,-4.267; 24 -0.2,-4.267; 25 0.2,-4.267; 26 0.6,-4.267; 27 1,-4.267; 28 1.4,-4.267; 29 1.8,-4.267; 30 2.2,-4.267; 31 2.6,-4.267; 32 3,-4.267; 49 3,4.267; 50 2.6,4.267; 51 2.2,4.267; 52 1.8,4.267; 53 1.4,4.267; 54 1,4.267; 55 0.6,4.267; 56 0.2,4.267; 57 -0.2,4.267; 58 -0.6,4.267; 59 -1,4.267; 60 -1.4,4.267; 61 -1.8,4.267; 62 -2.2,4.267; 63 -2.6,4.267; 64 -3,4.267 | smd 3.9 x 3.9: EPAD 0,0
DRT0003A = smd 0.3 x 0.45: 1 -0.35,-0.575; 2 0.35,-0.575; 3 0,0.575
RUK20_1P7X1P7 = smd 0.8 x 0.2: 1 -1.5,0.8; 2 -1.5,0.4; 3 -1.5,0; 4 -1.5,-0.4; 5 -1.5,-0.8; 11 1.5,-0.8; 12 1.5,-0.4; 13 1.5,0; 14 1.5,0.4; 15 1.5,0.8 | smd 0.2 x 0.8: 6 -0.8,-1.5; 7 -0.4,-1.5; 8 0,-1.5; 9 0.4,-1.5; 10 0.8,-1.5; 16 0.8,1.5; 17 0.4,1.5; 18 0,1.5; 19 -0.4,1.5; 20 -0.8,1.5 | smd 1.7 x 1.7: 21 0,0
CONN_10031569-001LF_AMP = drill 1.245 pad 1.245: 23 -19.99,5.563; 24 19.99,5.563 | drill 2.007 pad 2.007: 25 -23.012,1.549; 26 23.012,1.549 | smd 0.762 x 2.007: P1 1.905,5.153; P2 0.635,5.153; P3 -0.635,5.153; P4 -1.905,5.153; P5 -3.175,5.153; P6 -4.445,5.153; P7 -5.715,5.153; P8 -6.985,5.153; P9 -8.255,5.153; P10 -9.525,5.153; P11 -10.795,5.153; P12 -12.065,5.153; P13 -13.335,5.153; P14 -14.605,5.153; P15 -15.875,5.153; S1 15.875,5.153; S2 14.605,5.153; S3 13.335,5.153; S4 12.065,5.153; S5 10.795,5.153; S6 9.525,5.153; S7 8.255,5.153
POWER_JACK_PTH = drill 2.997 pad 4.318: GND 0,7.7; GNDBREAK 4.7,10.7; PWR 0,13.7
692121430000 = drill 0.7 pad 1.3: 1 -3.5,-0.24; 2 -1,-0.24; 3 1,-0.24; 4 3.5,-0.24; 5 4,1.26; 6 2,1.26; 7 0,1.26; 8 -2,1.26; 9 -4,1.26 | drill 2.3: S1 -6.57,-0.14; S2 6.57,-0.14
JP1 = drill 0.914 long: 1 0,-1.27; 2 0,1.27
WE-CBF_0603(W=2.2) = smd 0.75 x 0.7: 1 -0.725,0; 2 0.725,0
WE-MAPI_4020 = smd 0.98 x 3.7: 1 -1.185,0; 2 1.185,0
RES_0603 = smd 0.74 x 0.93: 1 -0.795,0; 2 0.795,0
RES_0402 = smd 0.58 x 0.58: 1 -0.46,0; 2 0.46,0
SW_EVP-AWED2A_PAN = smd 0.559 x 1.499: 1 -1.626,0; 2 1.626,0
DRC10_2P4X1P65 = smd 0.85 x 0.28: 1 -1.475,1; 2 -1.475,0.5; 3 -1.475,0; 4 -1.475,-0.5; 5 -1.475,-1; 6 1.475,-1; 7 1.475,-0.5; 8 1.475,0; 9 1.475,0.5; 10 1.475,1
ABM3B-40.000MHZ-B2-T = smd 1.8 x 1.2: 1 -2,-1.2; 2 2,-1.2; 3 2,1.2; 4 -2,1.2

### Placement (x,y rotation side)
C1  11.56,11.99 270 top
C2  11.43,21.97 270 top
C3  29.01,25.43 270 top
C4  9.78,36.55 0 bottom
C5  9.73,39.09 0 bottom
C6  9.73,40.34 0 bottom
C7  9.78,35.28 0 bottom
C8  11.89,51.87 90 top
C9  13.74,48.87 180 top
C10  9.73,43.41 180 top
C11  9.93,30.43 180 bottom
C12  33.25,19.13 0 top
C13  38.3,12.52 90 top
C14  26.85,37.52 180 top
C15  19.3,29.72 90 bottom
C16  15.57,4.11 0 top
C17  23.44,3.56 180 top
C18  23.44,2.57 180 top
C19  13.39,14.55 270 bottom
C20  15.24,12.98 180 bottom
C21  14.63,6.71 270 top
C22  16.81,6.71 270 top
C23  20.45,18.19 90 top
C24  21.54,18.19 270 top
C25  27.51,51.97 90 top
C26  21.51,51.97 270 top
C27  10.85,51.87 270 top
C28  23.52,51.94 270 top
C30  26.85,38.51 180 top
C31  10.97,39.5 0 top
C32  19.51,45.77 270 top
C33  24.23,45.72 270 top
C34  25.25,45.72 270 top
C35  26.92,43.28 180 top
C36  26.95,34.37 180 top
C37  21.46,29.74 90 bottom
C38  16.23,29.77 90 top
C39  11,33.66 180 top
C40  10.97,37.47 0 top
C41  10.97,38.46 0 top
C42  9.75,41.45 0 top
C43  11,32.64 180 top
C44  16.08,45.77 270 top
C45  18.52,46.63 270 top
C46  9.96,27.66 0 bottom
D1  32.79,29.26 90 top
D2  32.79,30.45 90 top
D3  32.79,34.01 90 top
D4  32.79,36.4 90 top
D5  32.79,37.62 90 top
D6  32.79,31.65 90 top
D7  32.79,32.82 90 top
D8  32.79,35.2 90 top
F1  11.15,5.89 180 bottom
IC1  23.01,23.95 0 top
IC2  19.56,37.72 90 top
IC3  19.43,51.89 180 top
IC4  22.53,49.91 180 bottom
IC5  16.56,51.84 180 top
IC7  20.14,13.21 0 top
J1  1.07,25.76 90 bottom
J2  31.9,-2.59 0 top
J3  19.51,56.49 180 top
JP1  16.69,26.92 270 top
L1  10.36,29.03 180 bottom
L2  20.04,7.67 90 top
L3  36.04,40.34 180 top
R1  10.39,25.48 0 bottom
R2  9.52,19.46 90 bottom
R3  9.65,8.69 90 bottom
R4  27.86,25.43 90 top
R5  18.14,23.8 90 top
R6  26.92,41.25 0 top
R7  26.92,42.24 0 top
R8  36.09,29.57 0 top
R9  36.09,34.16 0 top
R10  20.45,48.9 90 bottom
R11  11.76,43.41 0 top
R12  36.09,28.07 0 top
R13  36.09,37.19 0 top
R14  36.09,38.68 0 top
R15  36.09,31.09 0 top
R16  36.09,32.66 0 top
R17  36.09,35.66 0 top
R18  9.83,51.87 90 top
R19  15.57,2.44 180 top
R20  23.44,4.55 0 top
R21  15.24,14.07 180 bottom
R22  15.57,1.4 180 top
R23  19.3,18.19 90 top
R25  23.44,1.55 180 top
R26  10.44,1.52 0 top
R28  15.75,6.71 270 top
R29  24.16,12.42 0 top
R31  26.44,51.97 90 top
R33  25.4,51.97 270 top
SW1  15.04,17.45 180 bottom
U7  19.63,2.84 0 top
Y1  12.22,46.13 0 top

### Tracks (layer width: path | path; a pad name or v marks a point on that pad's centre or on a via)
1.8V
  Top 0.203: IC7.17 20.54,15.34 20.6,15.39 20.85,15.39 | IC7.16 20.94,15.3 20.85,15.39 | 20.85,15.39 21.54,16.08 C24.2
2.8V  (via drill 0.2)
  Top 0.203: C31.2 11.45,40.3 11.58,40.44 v11.94,40.44 6.76,40.44 6.32,40 6.32,31.78 6.63,31.47 v10.41,31.47 | v13.69,39.98 14.02,39.98 14.1,39.9 15.28,39.9 IC2.51 | IC2.7 18.96,32.06 18.8,31.9 v18.57,31.9 | IC2.24 24.97,37.52 25.1,37.64 25.1,38.4 25.22,38.53 v25.5,38.53 26.35,38.53 C30.2 C14.2 | v12.04,31.9 v15.14,31.9 | v28.52,40.67 27.66,40.67 27.38,40.94 R6.2 27.49,41.35 27.49,42.14 R7.2
  Bottom 0.203: v11.94,40.44 13.59,40.44 13.69,40.34 v13.69,39.98 | v12.04,31.9 10.69,31.9 10.41,31.62 v10.41,31.47 C11.2 | C15.2 19.3,31.8 19.2,31.9 v18.57,31.9 v15.14,31.9 15.14,33.3 15.24,33.4 23.8,33.4 23.95,33.55 23.95,38.35 24.13,38.53 v25.5,38.53 27.99,38.53 28.52,39.07 v28.52,40.67
  Bottom 0.406: L1.2 11.09,30.26 10.92,30.43 C11.2
3.3VDDA  (via drill 0.2)
  Top 0.203: IC2.62 13.3,35.52 v13.08,35.74 | IC2.48 16.56,43.34 16.41,43.48 15.11,43.48 14.88,43.26 v14.88,42.04 | IC2.34 22.16,44.05 22.43,44.32 v23.32,44.32 24.03,44.32 24.23,44.53 C33.2 | v20.28,44.81 19.79,45.3 C32.2 19.51,44.78 19.71,44.58 19.71,44.55 19.76,44.5 IC2.40 | L3.2 35.32,44.79 34.87,45.24 v27.25,45.24
  Bottom 0.203: v13.08,35.74 14.71,35.74 14.88,35.92 v14.88,42.04 15.37,42.52 22.73,42.52 23.32,43.1 v23.32,44.32 | v23.32,44.32 23.32,45.64 23.09,45.87 20.42,45.87 20.22,45.67 20.22,44.83 20.24,44.81 v20.28,44.81 | v27.25,45.24 27.25,44.68 26.9,44.32 v23.32,44.32
5V  (via drill 0.2)
  Top 0.203: C18.2 22.56,2.57 22.28,2.84 U7.8 20.24,2.84 v19.79,2.39 | v9.14,2.39 9.14,2.92 9.32,3.1 9.32,19.87 9.68,20.22
  Top 0.254: 9.68,20.22 C2.1
  Bottom 0.254: v19.79,2.39 v9.14,2.39
  Bottom 0.762: R2.1 9.51,18.64 8.23,18.64 8.1,18.77 J1.P8 J1.P9
  Bottom 0.813: R2.1 11.12,18.66 11.43,18.97 C2.1
12V  (via drill 0.85 pad 1.3)
  Top 0.762: J2.PWR 34.62,11.11 | 34.62,11.11 35.14,11.11 36.08,12.05 | C13.1 36.08,12.05 | 36.08,12.05 35.75,12.37 | 35.75,12.37 C12.1 | 35.75,12.37 34.62,11.25 34.62,11.11
  Top 0.813: v24.03,8.2 29,8.2 J2.PWR
  Bottom 0.813: F1.2 23.42,5.89 24.03,6.5 v24.03,8.2
AGND  (via drill 0.2, 0.4)
  Top 0.203: 20.65,12.81 20.54,12.81 IC7.21 | 20.65,12.81 20.54,12.7 IC7.9 | v23.01,12.52 22.73,12.81 IC7.12 20.65,12.81
  Top 0.508: R26.1 9.98,11.66 10.29,11.96 v14.78,11.96
  Bottom 0.203: v23.01,12.52 22.35,13.18 18.69,13.18
  Bottom 0.406: 16.92,12.7 17.4,13.18 18.69,13.18
  Bottom 0.508: C20.1 14.78,12.96 v14.78,11.96 16.18,11.96 16.92,12.7
B_3.3V  (via drill 0.2, 0.35, 0.4)
  Top 0.203: IC7.14 22.43,13.61 22.5,13.54 22.5,13.26 22.45,13.21 IC7.13 v25.53,13.21 25.53,19.25 25.07,19.71 19.3,19.71 | R23.2 19.3,19.71 | 19.3,19.71 19.3,20.24 19.08,20.47 18.87,20.47 17.27,20.47 16.99,20.75 16.99,24.08 17.22,24.31 18.09,24.31 R5.2 12.57,24.26 12.24,24.59 12.24,26.44 11.96,26.72 v11.61,26.72
  Top 0.254: IC1.8 25.35,25.83 23.37,25.83 22.66,25.12 22.66,20.78 22.35,20.47 19.46,20.47 | 18.87,20.47 19.46,20.47 | 19.3,20.24 19.3,20.32 19.46,20.47
  Top 0.305: R23.2 20.43,18.65 C23.2
  Top 0.406: IC1.8 25.4,25.89 R4.2 | R22.2 v12.55,1.4 | v26.44,4.55 R20.2
  Top 0.762: R4.2 27.86,26.7 28.14,26.97 36.45,26.97 36.89,27.41 R12.2 R8.2 R15.2 R16.2 R9.2 R17.2 R13.2 R14.2 36.89,39.69 36.77,39.81 L3.1
  Bottom 0.203: v11.61,26.72 11.52,26.72 11.18,26.38 | v26.44,4.55 26.44,12.98 26.21,13.21 v25.53,13.21
  Bottom 0.406: v26.44,4.55 26.49,4.5 26.72,4.5 26.97,4.24 26.97,1.68 26.7,1.4 v12.55,1.4
  Bottom 0.508: R1.1 11.18,26.38 10.9,26.67 9.7,26.67 9.48,26.89 C46.2
  Bottom 0.762: J1.P2 J1.P1 | J1.P1 C46.2 | L1.1 6.78,29.03 6.22,28.47 J1.P1
BOARD_5V  (via drill 0.2, 0.4)
  Top 0.203: C17.2 22.33,3.56 22.12,3.34 U7.9 v19.85,3.34 v19.84,3.35 | IC7.3 17.83,13.21 17.7,13.08 17.7,12.88 | 17.7,12.88 17.78,12.8 IC7.4 | IC7.19 19.74,15.4 19.81,15.47 19.94,15.47 | IC7.18 20.14,15.37 20.04,15.47 19.94,15.47 | IC7.8 20.14,10.9 20.27,10.77 v20.45,10.77 20.83,10.77 20.94,10.88 IC7.10 | 19.94,15.47 v19.94,16.36 | v24.26,14 21.65,14 IC7.15 | v17.25,11.99 17.7,12.45 17.7,12.88
  Bottom 0.203: v20.45,10.77 20.45,11.79 20.22,12.01 17.27,12.01 v17.25,11.99 | v19.94,16.36 23.85,16.36 24.26,15.95 v24.26,14 24.54,13.72 24.54,10.77
  Bottom 0.254: v20.45,10.77 24.54,10.77 25.48,10.77 25.73,10.52 25.73,3.71 25.37,3.35 v19.84,3.35
  Bottom 0.406: R21.1 C19.2 13.39,11.3 13.77,10.92 17.02,10.92 17.25,11.15 v17.25,11.99
CAP_SATARX_N
  Bottom 0.152: J1.S5 7.53,36.55 8.01,36.07 9.3,36.07 9.3,36.08 C4.2
CAP_SATARX_P
  Bottom 0.152: J1.S6 7.53,35.28 8.01,35.76 9.3,35.76 C7.2
CAP_SATATX_N
  Bottom 0.152: C6.2 9.25,40.1 9.02,39.87 7.34,39.87 6.84,40.36 J1.S2
CAP_SATATX_P
  Bottom 0.152: C5.2 9.25,39.52 9.21,39.56 7.31,39.56 6.84,39.09 J1.S3
CAP_SSTX_N  (via drill 0.2)
  Top 0.152: J3.8 21.64,55.23 22.36,54.51 22.36,53.89 21.51,53.04 C26.1 21.52,52.45 v22.15,52.45
  Bottom 0.152: IC4.1 22.18,52.42 v22.15,52.45
CAP_SSTX_P  (via drill 0.2)
  Top 0.152: J3.9 23.39,55.23 22.67,54.51 22.67,53.86 23.52,53.01 C28.1 23.49,52.45 v22.86,52.45
  Bottom 0.152: IC4.2 22.88,52.45 v22.86,52.45
FAULT#  (via drill 0.2)
  Top 0.203: U7.6 19.42,1.84 19.25,2.01 19.25,3.66 19.44,3.84 U7.10 21.83,3.84 22.02,4.04 22.02,4.44 22.12,4.55 R20.1 22.98,11.33 23.24,11.58 26.82,11.58 27.18,11.94 v27.18,19.89 | IC2.23 25.08,37.12 v25.53,37.57 v25.54,37.57
  Bottom 0.203: v27.18,19.89 27.58,20.29 30.84,20.29 31.29,20.75 31.29,37.01 30.73,37.57 v25.54,37.57
FUSE_12V
  Bottom 0.762: J1.P14 J1.P15 6.22,8.21 6.58,7.85 9.61,7.85 | 9.61,7.85 R3.1 11.19,7.89 11.56,8.25 C1.1 | F1.1 9.68,7.78 9.61,7.85
GND  (via drill 0.2)
  Top 0.203: C13.2 37.24,13 v37.03,13.21 | U7.4 18.75,2.34 18.9,2.49 18.9,3.71 | U7.1 18.76,3.84 18.9,3.71 | 18.9,3.71 18.9,4.93 18.52,5.31 15.37,5.31 15.06,5 15.06,4.15 C16.1 v12.19,4.11 | C39.2 10.57,33.7 v10.57,34.39 | C21.1 v14.63,7.95 | IC7.6 19.34,11.14 19.15,10.95 v18.36,10.95 | C3.1 v29.99,25.9 v30,25.91 | IC1.4 v18.85,22.05 | R18.1 9.8,51.38 v9.8,50.47 | C38.1 14.38,29.29 v14.33,29.24 | C23.1 20.85,17.71 21,17.86 21,18.01 21.01,18.02 21.01,18.31 21.35,18.66 C24.1 | R29.2 v25.55,12.42 | C18.1 v26.16,2.57 | C45.1 18.19,47.44 v18.19,47.8
  Bottom 0.203: J1.P10 v8.23,16.23 | J1.P12 v8.33,13.69 | J1.P5 v8.64,22.58 | v14.33,29.24 C15.1 21.44,29.24 C37.1
  other vias: 16.92,47.17 24.46,52.5 22.86,18.62 27.61,32.61 20.68,16.92
  pour Top: 0.03,59.97 39.95,59.97 39.95,0.03 0.03,0.03 0.03,6.99 4.09,6.99 4.09,44.98 0.05,44.98 0.03,45.01
  pour Bottom: 0,59.99 0,45.03 0.03,45.01 4.06,45.01 4.09,44.98 4.09,6.99 0.03,6.99 0,6.96 0,0 39.95,0 39.95,59.97 0.03,59.97
GRST#  (via drill 0.2)
  Top 0.203: IC7.20 19.34,17.69 R23.1 19.28,17.7 18.34,17.7 18.19,17.86 v18.19,19.71 | IC2.4 17.76,30.83 v17.98,30.61
  Bottom 0.203: v18.19,19.71 13.61,19.71 13.21,20.12 13.21,30.02 13.79,30.61 v17.98,30.61
HDD_ACT#
  Top 0.203: D1.C 32,28.57 31.79,28.37 17.22,28.37 16.96,28.63 IC2.2
HS_FS_CONNECT#
  Top 0.203: IC2.15 22.16,30.72 22.38,30.51 28.42,30.51 28.65,30.73 28.65,36.04 29.01,36.4 D4.C
HS_FS_SUSPEND#
  Top 0.203: IC2.10 20.16,30.08 20.45,29.79 29.24,29.79 29.41,29.97 29.41,33.76 29.67,34.01 D3.C
MISC_LED0#
  Top 0.203: D2.C 30.78,30.45 30.58,30.25 30.58,28.88 30.43,28.73 17.65,28.73 17.36,29.02 IC2.3
N$1
  Bottom 0.762: J1.P3 8.18,25.12 8.53,25.48 R1.2
N$2
  Bottom 0.762: J1.P13 9.19,12.42 9.65,11.96 R3.2
N$3
  Bottom 0.762: J1.P7 7.87,20.04 8.08,20.25 R2.2
N$12  (via drill 0.2)
  Top 0.203: IC7.1 16.42,14.01 v16.36,14.07
  Bottom 0.203: v16.36,14.07 R21.2
  Bottom 0.406: v16.36,14.07 16.36,15.54 16.66,15.85 SW1.2
N$13
  Top 0.203: R25.2 22.19,2.34 U7.7
N$14  (via drill 0.2)
  Top 0.203: IC7.2 16.96,13.61 v16.33,12.98
  Bottom 0.203: v16.33,12.98 C20.2
N$16
  Top 0.203: IC1.2 18.95,24.59 17.96,25.58 JP1.2
N$18
  Top 0.203: R5.1 20.63,23.34 IC1.3
N$19
  Top 0.203: IC1.7 26.77,24.59 27.15,24.97 R4.1 28.99,24.97 C3.2
N$22
  Top 0.203: R6.1 26.44,41.22 26.44,40.26 26.1,39.92 IC2.30
N$23
  Top 0.203: IC2.31 25.41,40.32 25.7,40.61 25.7,42.11 25.83,42.24 R7.1
N$24  (via drill 0.2)
  Top 0.203: IC2.38 20.56,43.24 20.68,43.36 v20.8,43.36
  Bottom 0.203: v20.8,43.36 20.32,42.88 14.58,42.88 14.25,43.21 14.25,48.95 14.66,49.35 R10.2
N$25  (via drill 0.2)
  Top 0.203: IC2.39 20.16,43.42 20.24,43.51 v20.22,43.53
  Bottom 0.203: v20.22,43.53 19.92,43.23 14.96,43.23 14.61,43.59 14.61,48.08 14.96,48.43 R10.1
N$26
  Top 0.203: Y1.1 10.2,44.91 C10.1 R11.1 11.3,42.4 11.43,42.27 12.88,42.27 13,42.14 13,39.88 13.36,39.52 IC2.52
N$27  (via drill 0.2)
  Top 0.203: C9.1 Y1.3 14.2,47.35 12.5,47.35 12.22,47.07 R11.2 12.22,42.8 v12.24,42.77 | v12.24,41.66 12.6,41.3 12.6,39.71 13.2,39.11 14.08,39.11 14.12,39.07 14.12,38.81 14.21,38.72 IC2.54
  Bottom 0.203: v12.24,41.66 v12.24,42.77
N$28
  Top 0.254: R12.1 33.73,28.07 33.55,28.24 33.55,29.23 D1.A
N$29
  Top 0.254: R8.1 34.67,29.57 34.57,29.67 34.57,30.33 34.44,30.45 D2.A
N$30
  Top 0.254: D3.A 34.29,34.01 34.44,34.16 R9.1
N$31
  Top 0.254: D4.A 34.04,36.4 34.82,37.19 R13.1
N$32
  Top 0.254: D5.A 33.59,38.51 33.78,38.71 35.27,38.71 R14.1
N$33
  Top 0.254: D6.A 34.09,31.65 34.65,31.09 R15.1
N$34
  Top 0.254: D7.A 34.39,32.82 34.54,32.66 R16.1
N$35
  Top 0.254: D8.A 34.19,35.2 34.65,35.66 R17.1
N$46  (via drill 0.2)
  Top 0.203: IC7.7 19.74,10.69 20.04,10.39 v20.04,10.03 L2.2
N$48  (via drill 0.2)
  Top 0.203: R28.1 16.8,7.17 C22.1 v16.81,7.95 | IC7.11 21.66,12.4 22.3,12.4 22.3,11.96 | v22.3,10.21 22.3,11.96 | R29.1 23.24,11.96 22.3,11.96
  Bottom 0.203: v16.81,7.95 22.02,7.95 22.3,8.23 v22.3,10.21
N$50  (via drill 0.2)
  Top 0.203: R31.1 R33.2 v24.49,51.51 | IC2.50 14.18,40.32 14.17,40.34 14.1,40.34 13.51,40.92 v13.51,42.9
  Bottom 0.203: v13.51,42.9 13.51,49.56 13.89,49.94 24.33,49.94 24.49,50.09 v24.49,51.51
N$54
  Top 0.762: J3.S1 26.08,57.64 25.19,58.53 13.61,58.53 12.94,57.85 J3.S2 11.89,55.58 C8.2 C27.1 10.83,52.33 R18.2
PWR_STATE_0
  Top 0.203: D7.C 30.02,32.82 29.77,32.56 29.77,29.64 29.57,29.44 19.99,29.44 19.76,29.67 IC2.9
PWR_STATE_1
  Top 0.203: IC2.14 21.76,30.46 22.07,30.15 28.78,30.15 29.01,30.38 29.01,34.85 29.36,35.2 D8.C
SATA_EN  (via drill 0.2)
  Top 0.203: U7.5 17.31,1.84 16.87,1.4 R22.1 R19.1 16.03,2.92 15.72,3.23 11.4,3.23 11,3.63 11,8.36 11.35,8.71 15.72,8.71 16.05,9.04 16.05,12.22 15.52,12.75 15.52,20.27 15.93,20.68 v16.28,20.68 | v25.73,36.88 25.57,36.72 IC2.22
  Bottom 0.203: v16.28,20.68 30.33,20.68 30.89,21.23 30.89,36.68 30.68,36.88 v25.73,36.88
SATARX_N  (via drill 0.2)
  Top 0.152: v11.02,36.55 11.59,36.55 12.01,36.96 14.07,36.96 14.32,36.72 IC2.59
  Bottom 0.152: C4.1 v11.02,36.55
SATARX_P  (via drill 0.2)
  Top 0.152: v11.02,35.28 12.31,36.57 12.31,36.61 12.36,36.66 13.68,36.66 14.02,36.32 IC2.60
  Bottom 0.152: C7.1 v11.02,35.28
SATATX_N  (via drill 0.2)
  Top 0.152: IC2.56 13.57,37.92 v13.36,38.13
  Bottom 0.152: C6.1 10.8,40.34 11.27,39.87 12.72,39.87 13.36,39.23 v13.36,38.13
SATATX_P  (via drill 0.2)
  Top 0.152: IC2.57 13.13,37.52 12.75,37.9 v12.75,38.15
  Bottom 0.152: C5.1 10.8,39.09 11.27,39.56 12.6,39.56 12.75,39.41 v12.75,38.15
SPI_CE#  (via drill 0.2)
  Top 0.203: v27.66,35.66 27.66,35.99 27.33,36.32 IC2.21 | IC1.1 v22.17,25.86
  Bottom 0.203: v27.66,35.66 27.61,35.71 26.67,35.71 26.44,35.48 26.44,33.5 26.14,33.2 25.32,33.2 25.07,32.94 25.07,28.7 24.89,28.52 14.86,28.52 14.38,28.04 14.38,25.37 14.86,24.89 22,24.89 22.17,25.07 v22.17,25.86
SPI_SCK  (via drill 0.2)
  Top 0.203: IC1.6 v23.8,23.32 | v26.09,31.47 24.16,31.47 23.83,31.8 IC2.17
  Bottom 0.203: v23.8,23.32 25.81,23.32 26.09,23.6 v26.09,31.47
SPI_SI  (via drill 0.2)
  Top 0.203: v27.03,35.23 27.03,35.59 26.69,35.92 IC2.20
  Bottom 0.203: JP1.1 15.42,25.53 15.65,25.3 19.33,25.3 19.69,25.65 19.69,26.87 20.04,27.23 25.15,27.23 25.48,27.56 25.48,32.38 25.83,32.74 26.75,32.74 27.03,33.02 v27.03,35.23
SPI_SO  (via drill 0.2)
  Top 0.203: IC2.18 24.94,35.12 25.2,34.86 25.2,32.44 25.5,32.13 27.28,32.13 27.61,31.8 v27.61,31.47 | IC1.5 v26.95,22.05
  Bottom 0.203: v27.61,31.47 26.95,30.81 v26.95,22.05
SS_CONNECT#
  Top 0.203: D5.C 28.63,37.62 28.3,37.29 28.3,31.09 28.07,30.86 22.79,30.86 22.56,31.1 IC2.16
SSRX_N  (via drill 0.2)
  Top 0.152: IC2.45 17.76,43.18 17.71,43.23 17.71,52.22 17.51,52.42 IC5.1 v16.91,52.98 v16.92,52.98
  Bottom 0.152: v16.92,52.98 15.85,52.98 15.49,53.34 15.49,55.22 J3.5
SSRX_P
  Top 0.152: IC2.46 17.36,43.18 17.41,43.23 17.41,51.66 17.25,51.82 16.33,51.82 16.21,51.94 IC5.2 16.21,53.93 J3.6
SSTX_N  (via drill 0.2)
  Top 0.152: C26.2 21.51,50.9 22.36,50.05 22.36,45.67 22.07,45.38 v22.07,45.19 | v18.57,44.42 18.96,44.03 IC2.42
  Bottom 0.152: v22.07,45.19 22.23,45.03 22.23,44.5 22.07,44.35 18.64,44.35 v18.57,44.42
SSTX_P  (via drill 0.2)
  Top 0.152: C28.2 23.52,50.87 22.67,50.02 22.67,45.67 22.68,45.66 v22.68,45.19 | v18.54,43.84 18.56,43.82 IC2.43
  Bottom 0.152: v22.68,45.19 22.53,45.03 22.53,44.37 22.2,44.04 18.78,44.04 18.74,44.01 18.71,44.01 v18.54,43.84
SW_HB
  Top 0.203: D6.C 30.45,31.65 30.12,31.32 30.12,29.26 29.95,29.08 19.53,29.08 19.36,29.26 IC2.8
USB_D_N
  Top 0.152: J3.2 20.51,54.8 20.5,54.79 20.45,54.79 19.58,53.92 19.58,53.19 19.78,53 IC3.1 18.88,51.56 18.67,51.56 18.67,48.39 19.33,47.73 20.42,47.73 21.01,47.14 21.01,44.5 21.76,43.75 IC2.35
USB_D_P
  Top 0.152: J3.3 18.49,56.71 18.49,54.69 18.52,54.69 19.28,53.92 19.28,53.19 19.08,53 IC3.2 19.05,52.47 18.36,51.78 18.36,48.26 19.2,47.42 20.29,47.42 20.7,47.02 20.7,44.37 21.36,43.72 IC2.36
VDD_1.1V  (via drill 0.2)
  Top 0.203: IC2.33 v23.47,41.99 23.62,41.99 23.83,41.78 IC2.32 25.05,40.72 25.3,40.97 25.3,42.93 25.65,43.28 C35.2 26.45,44.92 26.11,45.26 25.27,45.26 C34.2 | IC2.47 16.96,43.75 16.78,43.93 | 16.78,43.93 16.08,44.63 C44.2 v16.79,45.29 | IC2.63 13.92,35.12 | 13.92,35.12 13.64,35.12 | 13.64,35.12 13.37,35.12 | C39.1 v12.42,33.65 | 13.64,34.85 13.64,33.58 13.77,33.45 IC2.1 16.56,32.05 16.23,31.72 C38.2 | 13.64,35.12 13.64,34.85 | 13.64,34.85 13.37,35.12 | 13.64,34.85 13.65,34.85 13.92,35.12 | C40.2 12.01,37.46 v12.14,37.59 12.12,37.62 12.12,38.51 12.27,38.66 13.72,38.66 14.06,38.32 IC2.55 | IC2.12 v20.96,31.8 | IC2.61 13.95,35.92 13.54,36.33 12.54,36.33 12.41,36.2 12.41,35.13 | v12.42,33.65 12.41,33.66 12.41,35.13 | 13.37,35.12 12.42,35.12 12.41,35.13 | v15.62,41.86 15.16,41.4 14.38,41.4 | 14.15,41.17 14.38,41.4 | 14.15,41.17 14.15,40.79 14.22,40.72 IC2.49 | 14.15,41.17 v14.15,41.4 | v14.15,41.4 v14.15,42.27 14.15,43.64 14.44,43.93 16.78,43.93 | C45.2 v18.52,45.29 18.52,45.16 19.36,44.32 IC2.41 | C42.2 v11,41.45 | 14.38,41.4 v14.15,41.4 | IC2.19 26.2,35.52 26.47,35.25 C36.2 v25.76,34.37 | C43.1 11.5,32.66 12.22,32.66 12.42,32.46 12.5,32.46 | v15.8,32.46 12.5,32.46 | v12.42,33.65 12.42,32.54 12.5,32.46 | C21.2 13.84,6.23 13.61,6.45 v13.61,7.7
  Top 0.305: C22.2 17.53,6.23 17.75,6.45 19.79,6.45 19.9,6.34
  Top 0.406: L2.1 19.9,6.34
  Top 0.762: C21.2 14.65,6.25 R28.2 16.8,6.25 C22.2 | C43.1 C39.1 | C40.2 C41.2
  Bottom 0.203: v20.96,31.8 21.21,31.8 21.46,31.55 C37.2 | v20.96,31.8 20.96,32.33 20.83,32.46 v15.8,32.46 | v18.52,45.29 v16.79,45.29 | v11,41.45 11.4,41.05 12.55,41.05 12.8,41.3 12.8,42.06 13,42.27 v14.15,42.27 | v14.15,41.4 14.43,41.12 14.43,37.74 14.27,37.59 v12.14,37.59 12.27,37.59 12.42,37.44 v12.42,33.65 12.65,33.65 13.06,33.25 13.06,31.11 12.42,30.48 12.42,17.53 11.94,17.04 10.21,17.04 9.86,16.69 9.86,13.08 10.95,11.99 12.45,11.99 12.73,11.71 12.73,8.59 v13.61,7.7 | v25.76,34.37 24.79,34.37 24.54,34.11 24.54,32.26 24.08,31.8 v20.96,31.8
  Bottom 0.305: v23.47,41.99 15.75,41.99 v15.62,41.86
VIN  (via drill 0.2, 0.65 pad 1.05)
  Top 0.305: J3.1 23.46,56.73 26.44,53.75 v26.44,53.31 R31.2 | C16.2 16.05,3.51 16.21,3.34 16.87,3.34 | U7.2 16.87,3.34 | 16.87,3.34 16.87,2.9 16.93,2.83 18.15,2.83 U7.3
  Top 0.61: v17.07,4.47 16.4,4.47 C16.2
  Top 0.762: C25.2 27.49,52.43 R31.2
  Top 0.813: C25.2 v29.35,52.44 v29.36,52.45 | v27.43,6.22 25.45,6.22 v24.82,5.59
  Bottom 0.305: J3.1 23.46,56.73 26.44,53.75 v26.44,53.31
  Bottom 0.813: 32.08,52.45 v29.36,52.45 | 31.72,14.5 28.02,14.5 27.43,13.92 v27.43,6.22 | v24.82,5.59 24.82,4.7 24.38,4.27 17.27,4.27 v17.07,4.47
  Bottom 1.016: 31.72,14.5 33.2,15.98 33.2,51.33 32.08,52.45